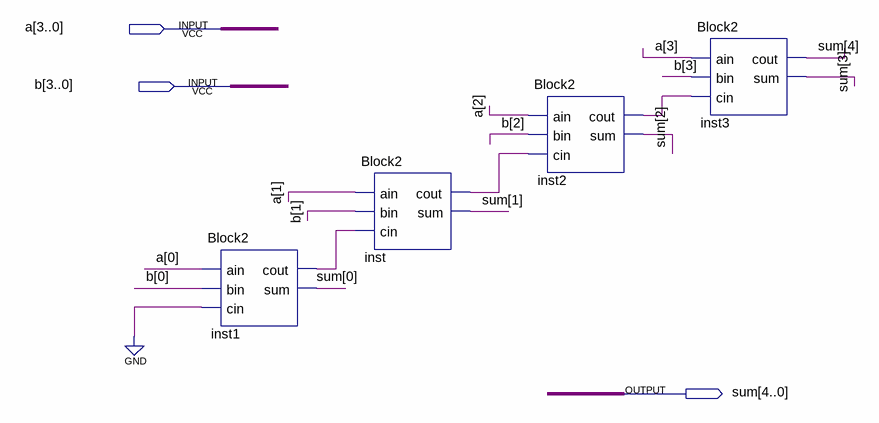
[diagram p0: schematic sheet]
// Quartus schematic Block3.bdf as structural Verilog: 4 symbols, 3 pins
module Block3 (
  input  [3:0] a,
  input  [3:0] b,
  output [4:0] sum
);

  wire inst1_cout, inst2_cout, inst_cout;

  Block2 inst1 (.ain(a[0]), .bin(b[0]), .cin(1'b0), .cout(inst1_cout), .sum(sum[0]));
  Block2 inst (.ain(a[1]), .bin(b[1]), .cin(inst1_cout), .cout(inst_cout), .sum(sum[1]));
  Block2 inst2 (.ain(a[2]), .bin(b[2]), .cin(inst_cout), .cout(inst2_cout), .sum(sum[2]));
  Block2 inst3 (.ain(a[3]), .bin(b[3]), .cin(inst2_cout), .cout(sum[4]), .sum(sum[3]));
endmodule
